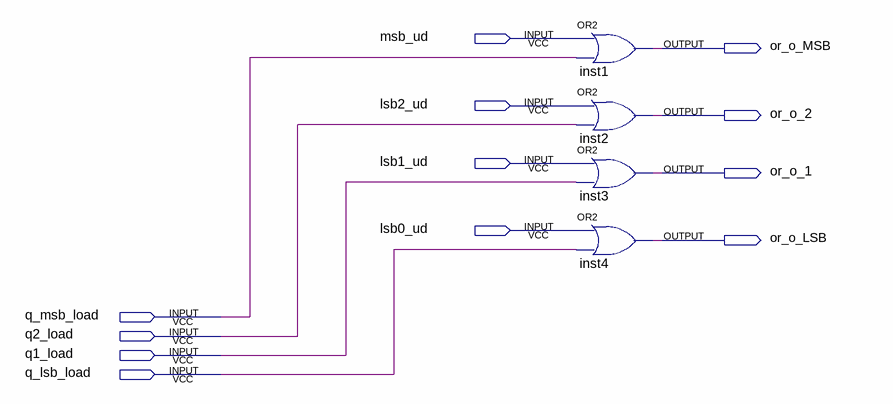
[diagram p0: schematic sheet]
// Quartus schematic or_output.bdf as structural Verilog: 4 symbols, 12 pins
module or_output (
  input  msb_ud,
  input  lsb2_ud,
  input  lsb1_ud,
  input  lsb0_ud,
  input  q_msb_load,
  input  q2_load,
  input  q1_load,
  input  q_lsb_load,
  output or_o_MSB,
  output or_o_2,
  output or_o_1,
  output or_o_LSB
);

  or inst1 (or_o_MSB, msb_ud, q_msb_load);
  or inst2 (or_o_2, lsb2_ud, q2_load);
  or inst3 (or_o_1, lsb1_ud, q1_load);
  or inst4 (or_o_LSB, lsb0_ud, q_lsb_load);
endmodule
